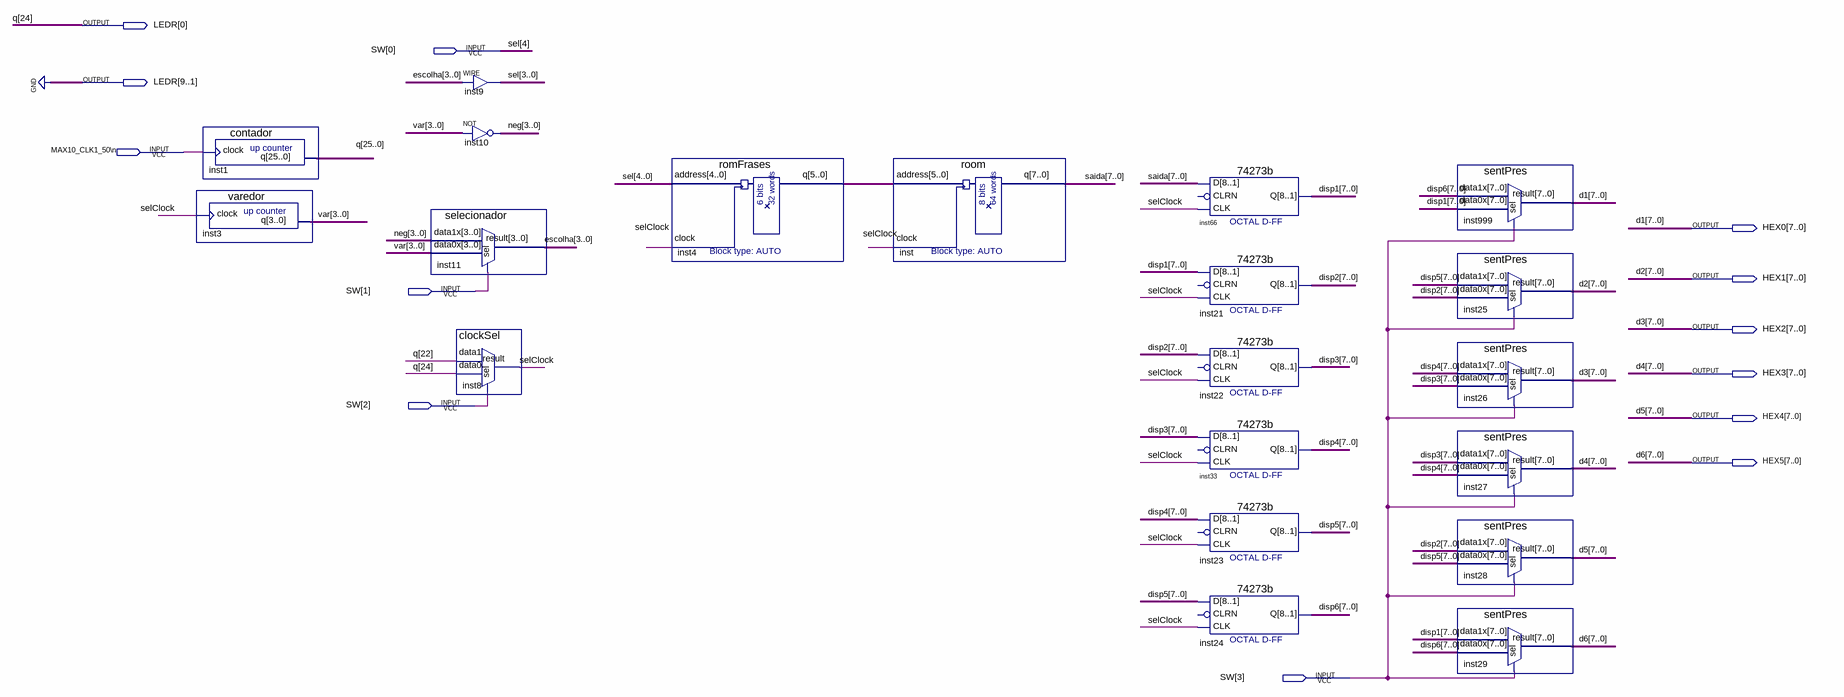
[diagram p0: schematic sheet]
// Quartus schematic projeto.bdf as structural Verilog: 20 symbols, 13 pins
module projeto (
  input  [3:0] SW,
  input  \MAX10_CLK1_50\n ,
  output [9:0] LEDR,
  output [7:0] HEX0,
  output [7:0] HEX1,
  output [7:0] HEX2,
  output [7:0] HEX3,
  output [7:0] HEX4,
  output [7:0] HEX5
);

  wire selClock;
  wire [3:0] escolha, neg, sel, \var ;
  wire [5:0] inst4_q;
  wire [7:0] disp1, disp2, disp3, disp4, disp5, disp6, saida;
  wire [25:0] q;

  contador inst1 (.clock(\MAX10_CLK1_50\n ), .q({q[25], LEDR[0], q[23:0]}));
  varedor inst3 (.clock(selClock), .q(\var ));
  selecionador inst11 (.data1x(neg), .data0x(\var ), .sel(SW[1]), .result(escolha));
  assign sel = escolha;  // WIRE inst9
  assign neg = ~\var ;  // NOT inst10, 4 bits wide
  clockSel inst8 (.data1(q[22]), .data0(LEDR[0]), .sel(SW[2]), .result(selClock));
  romFrases inst4 (.address({SW[0], sel}), .clock(selClock), .q(inst4_q));
  room inst (.address(inst4_q), .clock(selClock), .q(saida));
  \74273b  inst66 (.CLK(selClock), .D(saida), .Q(disp1));  // open: CLRN
  \74273b  inst21 (.CLK(selClock), .D(disp1), .Q(disp2));  // open: CLRN
  \74273b  inst22 (.CLK(selClock), .D(disp2), .Q(disp3));  // open: CLRN
  \74273b  inst33 (.CLK(selClock), .D(disp3), .Q(disp4));  // open: CLRN
  \74273b  inst23 (.CLK(selClock), .D(disp4), .Q(disp5));  // open: CLRN
  \74273b  inst24 (.CLK(selClock), .D(disp5), .Q(disp6));  // open: CLRN
  sentPres inst999 (.data1x(disp6), .data0x(disp1), .sel(SW[3]), .result(HEX0));
  sentPres inst25 (.data1x(disp5), .data0x(disp2), .sel(SW[3]), .result(HEX1));
  sentPres inst26 (.data1x(disp4), .data0x(disp3), .sel(SW[3]), .result(HEX2));
  sentPres inst27 (.data1x(disp3), .data0x(disp4), .sel(SW[3]), .result(HEX3));
  sentPres inst28 (.data1x(disp2), .data0x(disp5), .sel(SW[3]), .result(HEX4));
  sentPres inst29 (.data1x(disp1), .data0x(disp6), .sel(SW[3]), .result(HEX5));

  assign LEDR[9:1] = {9{1'b0}};

  // Other names for the same wires on the sheet: d1[7:0] = HEX0; d2[7:0] = HEX1; d3[7:0] = HEX2; d4[7:0] = HEX3;
  //   d5[7:0] = HEX4; d6[7:0] = HEX5; q[24] = LEDR[0]; sel[4] = SW[0]
endmodule
